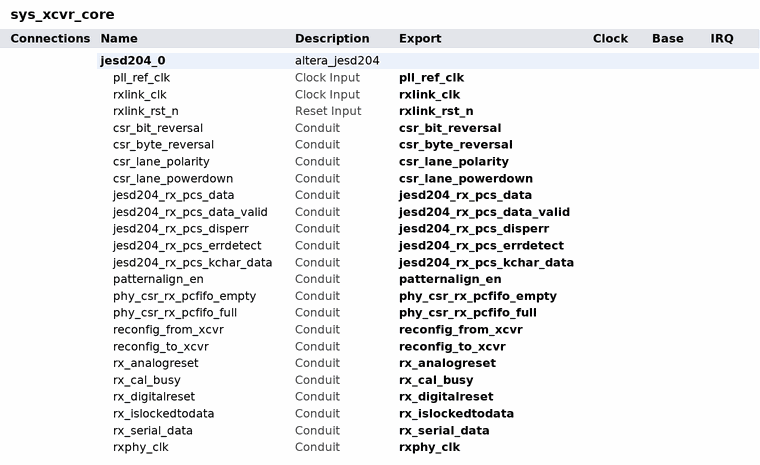
[diagram p0: system contents]
# Platform Designer (Qsys) system sys_xcvr_core, Arria V 5AGTFD7K3F40I3
# Parameters at their usual value, and those the tool derives, are not listed.
package require -exact qsys 15.0
create_system sys_xcvr_core
set_project_property DEVICE_FAMILY {Arria V}
set_project_property DEVICE 5AGTFD7K3F40I3

add_instance jesd204_0 altera_jesd204 15.0
set_instance_property jesd204_0 AUTO_EXPORT true
set_instance_parameter_value jesd204_0 ADJCNT 0
set_instance_parameter_value jesd204_0 ADJDIR 0
set_instance_parameter_value jesd204_0 BID 0
set_instance_parameter_value jesd204_0 CF 0
set_instance_parameter_value jesd204_0 CS 0
set_instance_parameter_value jesd204_0 DATA_PATH RX
set_instance_parameter_value jesd204_0 DID 0
set_instance_parameter_value jesd204_0 DLB_TEST 0
set_instance_parameter_value jesd204_0 ECC_EN 0
set_instance_parameter_value jesd204_0 GUI_CFG_F 4
set_instance_parameter_value jesd204_0 GUI_EN_CFG_F false
set_instance_parameter_value jesd204_0 HD 0
set_instance_parameter_value jesd204_0 JESDV 1
set_instance_parameter_value jesd204_0 K 32
set_instance_parameter_value jesd204_0 L 4
set_instance_parameter_value jesd204_0 LID0 0
set_instance_parameter_value jesd204_0 LID1 1
set_instance_parameter_value jesd204_0 LID2 2
set_instance_parameter_value jesd204_0 LID3 3
set_instance_parameter_value jesd204_0 LID4 4
set_instance_parameter_value jesd204_0 LID5 5
set_instance_parameter_value jesd204_0 LID6 6
set_instance_parameter_value jesd204_0 LID7 7
set_instance_parameter_value jesd204_0 M 4
set_instance_parameter_value jesd204_0 N 16
set_instance_parameter_value jesd204_0 N_PRIME 16
set_instance_parameter_value jesd204_0 OPTIMIZE 0
set_instance_parameter_value jesd204_0 PCS_CONFIG JESD_PCS_CFG1
set_instance_parameter_value jesd204_0 PHADJ 0
set_instance_parameter_value jesd204_0 REFCLK_FREQ 250.0
set_instance_parameter_value jesd204_0 RES1 0
set_instance_parameter_value jesd204_0 RES2 0
set_instance_parameter_value jesd204_0 S 1
set_instance_parameter_value jesd204_0 SCR 1
set_instance_parameter_value jesd204_0 SUBCLASSV 1
set_instance_parameter_value jesd204_0 TERMINATE_RECONFIG_EN false
set_instance_parameter_value jesd204_0 TEST_COMPONENTS_EN false
set_instance_parameter_value jesd204_0 bitrev_en false
set_instance_parameter_value jesd204_0 bonded_mode bonded
set_instance_parameter_value jesd204_0 lane_rate 5000.0
set_instance_parameter_value jesd204_0 part_trait_bd ARRIAVB7
set_instance_parameter_value jesd204_0 part_trait_dp 5AGTFD7K3F40I3
set_instance_parameter_value jesd204_0 pll_reconfig_enable false
set_instance_parameter_value jesd204_0 pll_type CMU
set_instance_parameter_value jesd204_0 rcfg_jtag_enable false
set_instance_parameter_value jesd204_0 sdc_constraint 1.0
set_instance_parameter_value jesd204_0 set_capability_reg_enable false
set_instance_parameter_value jesd204_0 set_csr_soft_logic_enable false
set_instance_parameter_value jesd204_0 set_prbs_soft_logic_enable false
set_instance_parameter_value jesd204_0 set_user_identifier 0
set_instance_parameter_value jesd204_0 wrapper_opt phy

# exported interfaces
add_interface csr_bit_reversal conduit end
set_interface_property csr_bit_reversal EXPORT_OF jesd204_0.csr_bit_reversal
add_interface csr_byte_reversal conduit end
set_interface_property csr_byte_reversal EXPORT_OF jesd204_0.csr_byte_reversal
add_interface csr_lane_polarity conduit end
set_interface_property csr_lane_polarity EXPORT_OF jesd204_0.csr_lane_polarity
add_interface csr_lane_powerdown conduit end
set_interface_property csr_lane_powerdown EXPORT_OF jesd204_0.csr_lane_powerdown
add_interface jesd204_rx_pcs_data conduit end
set_interface_property jesd204_rx_pcs_data EXPORT_OF jesd204_0.jesd204_rx_pcs_data
add_interface jesd204_rx_pcs_data_valid conduit end
set_interface_property jesd204_rx_pcs_data_valid EXPORT_OF jesd204_0.jesd204_rx_pcs_data_valid
add_interface jesd204_rx_pcs_disperr conduit end
set_interface_property jesd204_rx_pcs_disperr EXPORT_OF jesd204_0.jesd204_rx_pcs_disperr
add_interface jesd204_rx_pcs_errdetect conduit end
set_interface_property jesd204_rx_pcs_errdetect EXPORT_OF jesd204_0.jesd204_rx_pcs_errdetect
add_interface jesd204_rx_pcs_kchar_data conduit end
set_interface_property jesd204_rx_pcs_kchar_data EXPORT_OF jesd204_0.jesd204_rx_pcs_kchar_data
add_interface patternalign_en conduit end
set_interface_property patternalign_en EXPORT_OF jesd204_0.patternalign_en
add_interface phy_csr_rx_pcfifo_empty conduit end
set_interface_property phy_csr_rx_pcfifo_empty EXPORT_OF jesd204_0.phy_csr_rx_pcfifo_empty
add_interface phy_csr_rx_pcfifo_full conduit end
set_interface_property phy_csr_rx_pcfifo_full EXPORT_OF jesd204_0.phy_csr_rx_pcfifo_full
add_interface pll_ref_clk clock sink
set_interface_property pll_ref_clk EXPORT_OF jesd204_0.pll_ref_clk
add_interface reconfig_from_xcvr conduit end
set_interface_property reconfig_from_xcvr EXPORT_OF jesd204_0.reconfig_from_xcvr
add_interface reconfig_to_xcvr conduit end
set_interface_property reconfig_to_xcvr EXPORT_OF jesd204_0.reconfig_to_xcvr
add_interface rx_analogreset conduit end
set_interface_property rx_analogreset EXPORT_OF jesd204_0.rx_analogreset
add_interface rx_cal_busy conduit end
set_interface_property rx_cal_busy EXPORT_OF jesd204_0.rx_cal_busy
add_interface rx_digitalreset conduit end
set_interface_property rx_digitalreset EXPORT_OF jesd204_0.rx_digitalreset
add_interface rx_islockedtodata conduit end
set_interface_property rx_islockedtodata EXPORT_OF jesd204_0.rx_islockedtodata
add_interface rx_serial_data conduit end
set_interface_property rx_serial_data EXPORT_OF jesd204_0.rx_serial_data
add_interface rxlink_clk clock sink
set_interface_property rxlink_clk EXPORT_OF jesd204_0.rxlink_clk
add_interface rxlink_rst_n reset sink
set_interface_property rxlink_rst_n EXPORT_OF jesd204_0.rxlink_rst_n
add_interface rxphy_clk conduit end
set_interface_property rxphy_clk EXPORT_OF jesd204_0.rxphy_clk

set_interconnect_requirement {$system} qsys_mm.clockCrossingAdapter HANDSHAKE
set_interconnect_requirement {$system} qsys_mm.enableEccProtection FALSE
set_interconnect_requirement {$system} qsys_mm.insertDefaultSlave FALSE
set_interconnect_requirement {$system} qsys_mm.maxAdditionalLatency 1

save_system sys_xcvr_core.qsys
